# EAGLE design WoordklokCharles (EAGLE 7.2.0)
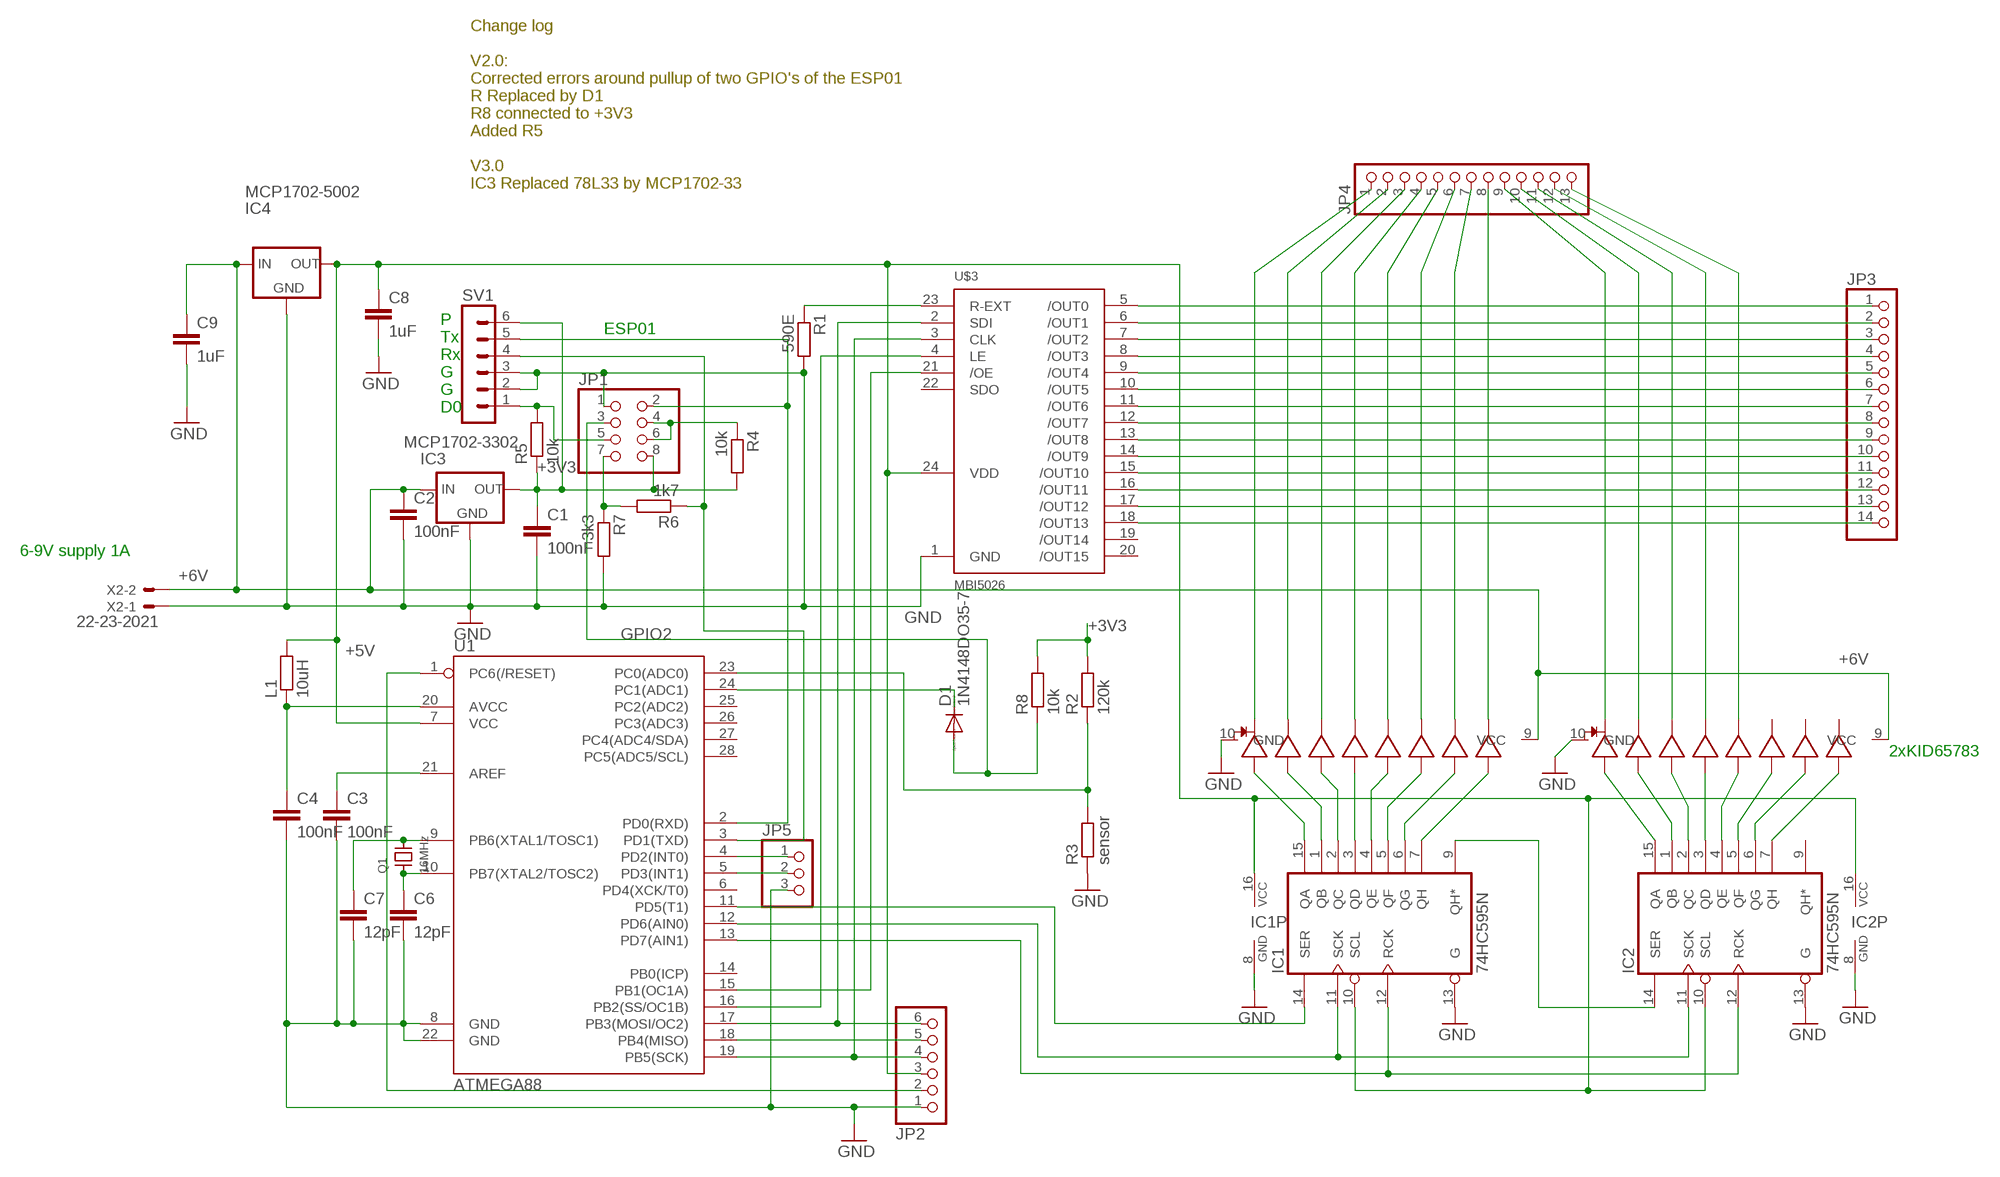
[diagram p0: schematic, sheet 1]

## Parts
C1  100nF  C-EU025-024X044  [C025-024X044]
C2  100nF  C-EU025-024X044  [C025-024X044]
C3  100nF  C-EU025-024X044  [C025-024X044]
C4  100nF  C-EU025-024X044  [C025-024X044]
C6  12pF  C-EU025-024X044  [C025-024X044]
C7  12pF  C-EU025-024X044  [C025-024X044]
C8  1uF  C-EU025-024X044  [C025-024X044]
C9  1uF  C-EU025-024X044  [C025-024X044]
D1  1N4148DO35-7  [DO35-7]
IC1  74HC595N  [DIL16]
IC2  74HC595N  [DIL16]
IC3  MCP1702-3302  MCP1700TRI  [TO92]
IC4  MCP1702-5002  MCP1700TRI  [TO92]
JP1  PINHD-2X4  [2X04]
JP2  PINHD-1X6  [1X06]
JP3  PINHD-1X14  [1X14]
JP4  PINHD-1X13  [1X13]
JP5  PINHD-1X3  [1X03]
L1  10uH  R-EU_0204/7  [0204/7]
Q1  16MHz  XTAL  [XTAL]
R1  590E  R-EU_0204/7  [0204/7]
R2  120k  R-EU_0204/7  [0204/7]
R3  sensor  R-EU_0204/7  [0204/7]
R4  10k  R-EU_0204/2V  [0204V]
R5  10k  R-EU_0204/2V  [0204V]
R6  1k7  R-EU_0204/7  [0204/7]
R7  3k3  R-EU_0204/7  [0204/7]
R8  10k  R-EU_0204/7  [0204/7]
SV1  MA06-1  [MA06-1]
U1  ATMEGA88  ATMEGA328P_PDIP  [DIL28-3]
U$1  KID65783  KID65783DIPDIP18  [DIP18]
U$2  KID65783  KID65783DIPDIP18  [DIP18]
U$3  MBI5026  MBI5026DIP  [DIP24]
X2  22-23-2021  [22-23-2021]

## Nets
+3V3: C1.1 IC3.3(OUT) JP1.8 R2.2 R4.2 R5.1 R8.2 SV1.6
+5V: C8.1 IC1.10(SCL) IC1.16(VCC) IC2.10(SCL) IC2.16(VCC) IC4.3(OUT) JP2.3 L1.2 U1.7(VCC) U$3.24(VDD)
+6V: C2.1 C9.1 IC3.2(IN) IC4.2(IN) U$1.9(VCC) U$2.9(VCC) X2.2
AVCC: C4.1 L1.1 U1.20(AVCC)
ESP2: JP1.2 SV1.5 U1.2(PD0(RXD))
ESP7: R6.1 SV1.4 U1.3(PD1(TXD))
GND: C1.2 C2.2 C3.2 C4.2 C6.2 C7.2 C8.2 C9.2 IC1.8(GND) IC1.13(G) IC2.8(GND) IC2.13(G) IC3.1(GND) IC4.1(GND) JP1.1 JP2.1 JP5.3 R1.2 R3.1 R7.2 SV1.2 SV1.3 U1.8(GND) U1.22(GND) U$1.10(GND) U$2.10(GND) U$3.1(GND) X2.1
GPIO2: D1.A JP1.3 R8.1
N$1: IC1.15(QA) U$1.8(IN7)
N$2: IC1.1(QB) U$1.7(IN6)
N$3: IC1.2(QC) U$1.6(IN5)
N$4: IC1.3(QD) U$1.5(IN4)
N$5: IC1.4(QE) U$1.4(IN3)
N$6: IC1.5(QF) U$1.3(IN2)
N$7: IC1.6(QG) U$1.2(IN1)
N$8: IC1.7(QH) U$1.1(IN0)
N$9: IC2.15(QA) U$2.8(IN7)
N$10: IC2.1(QB) U$2.7(IN6)
N$11: IC2.2(QC) U$2.6(IN5)
N$12: IC2.3(QD) U$2.5(IN4)
N$13: IC2.4(QE) U$2.4(IN3)
N$14: IC2.5(QF) U$2.3(IN2)
N$15: IC2.6(QG) U$2.2(IN1)
N$16: IC2.7(QH) U$2.1(IN0)
N$17: IC1.9(QH*) IC2.14(SER)
N$18: IC1.12(RCK) IC2.12(RCK) U1.13(PD7(AIN1))
N$19: IC1.11(SCK) IC2.11(SCK) U1.12(PD6(AIN0))
N$20: JP4.8 U$1.18(OUT0)
N$21: JP4.13 U$2.15(OUT3)
N$22: JP4.1 U$1.11(OUT7)
N$23: JP4.2 U$1.12(OUT6)
N$24: JP4.3 U$1.13(OUT5)
N$25: C3.1 U1.21(AREF)
N$26: JP3.2 U$3.6(/OUT1)
N$27: JP3.1 U$3.5(/OUT0)
N$28: R1.1 U$3.23(R-EXT)
N$29: JP1.5 R5.2 SV1.1
N$30: JP1.4 JP1.6 R4.1
N$31: JP2.4 U1.19(PB5(SCK)) U$3.3(CLK)
N$32: JP2.6 U1.17(PB3(MOSI/OC2)) U$3.2(SDI)
N$33: U1.16(PB2(SS/OC1B)) U$3.4(LE)
N$34: IC1.14(SER) U1.11(PD5(T1))
N$35: JP5.1 U1.4(PD2(INT0))
N$36: JP5.2 U1.5(PD3(INT1))
N$37: R2.1 R3.2 U1.23(PC0(ADC0))
N$38: JP2.5 U1.18(PB4(MISO))
N$39: JP2.2 U1.1(PC6(/RESET))
N$40: JP4.4 U$1.14(OUT4)
N$41: JP4.5 U$1.15(OUT3)
N$42: C7.1 Q1.P$2 U1.9(PB6(XTAL1/TOSC1))
N$43: C6.1 Q1.P$1 U1.10(PB7(XTAL2/TOSC2))
N$44: JP4.6 U$1.16(OUT2)
N$45: JP4.7 U$1.17(OUT1)
N$46: U1.15(PB1(OC1A)) U$3.21(/OE)
N$47: JP4.9 U$2.11(OUT7)
N$48: JP4.10 U$2.12(OUT6)
N$49: JP4.11 U$2.13(OUT5)
N$50: JP4.12 U$2.14(OUT4)
N$51: JP3.14 U$3.18(/OUT13)
N$52: JP3.3 U$3.7(/OUT2)
N$53: JP3.4 U$3.8(/OUT3)
N$54: JP3.5 U$3.9(/OUT4)
N$55: JP3.6 U$3.10(/OUT5)
N$56: JP3.7 U$3.11(/OUT6)
N$57: JP3.8 U$3.12(/OUT7)
N$58: JP3.9 U$3.13(/OUT8)
N$59: JP3.10 U$3.14(/OUT9)
N$60: JP3.11 U$3.15(/OUT10)
N$61: JP3.12 U$3.16(/OUT11)
N$62: JP3.13 U$3.17(/OUT12)
N$63: JP1.7 R6.2 R7.1
N$65: D1.C U1.24(PC1(ADC1))
Unconnected: IC2.9(QH*) U1.6(PD4(XCK/T0)) U1.14(PB0(ICP)) U1.25(PC2(ADC2)) U1.26(PC3(ADC3)) U1.27(PC4(ADC4/SDA)) U1.28(PC5(ADC5/SCL)) U$2.16(OUT2) U$2.17(OUT1) U$2.18(OUT0) U$3.19(/OUT14) U$3.20(/OUT15) U$3.22(SDO)

## Notes on the sheet
- Change log
  
  V2.0: 
  Corrected errors around pullup of two GPIO's of the ESP01
  R Replaced by D1
  R8 connected to +3V3
  Added R5
  
  V3.0 
  IC3 Replaced 78L33 by MCP1702-33
- ESP01
- P
  Tx
  Rx
  G
  G
  D0
- 6-9V supply 1A
- 2xKID65783

## Library data of the parts
C1-C4 C6-C9 = rcl:C-EU: CAPACITOR, European symbol
D1 = diode:1N4148: DIODE high speed (Philips)
IC1 IC2 = 74xx-eu:74*595: 8-bit SHIFT REGISTER, output latch
IC3 IC4 = adafruit:MCP1700: VOLTAGE REGULATOR
JP1 = adafruit:PINHD-2X4: PIN HEADER
JP2 = adafruit:PINHD-1X6: PIN HEADER
JP3 = adafruit:PINHD-1X14: PIN HEADER
JP4 = adafruit:PINHD-1X13: PIN HEADER
JP5 = adafruit:PINHD-1X3: PIN HEADER
L1 R1-R8 = rcl:R-EU_: RESISTOR, European symbol
Q1 = xtal-cvdo:XTAL
SV1 = con-lstb:MA06-1: PIN HEADER; OC_FARNELL: unknown; OC_NEWARK: unknown
U1 = SparkFun-DigitalIC:ATMEGA328P_PDIP: uC used in the Arduino 32kb flash, 1k EEPROM, 2k SRAM This is the through-hole version of this chip.
U$1 U$2 = KID65783:KID65783DIP
U$3 = LedDrivers:MBI5026DIP
X2 = con-molex:22-23-2021: .100" (2.54mm) Center Header - 2 Pin; MF: MOLEX; MPN: 22-23-2021; OC_FARNELL: 1462926; OC_NEWARK: 25C3832

## Board
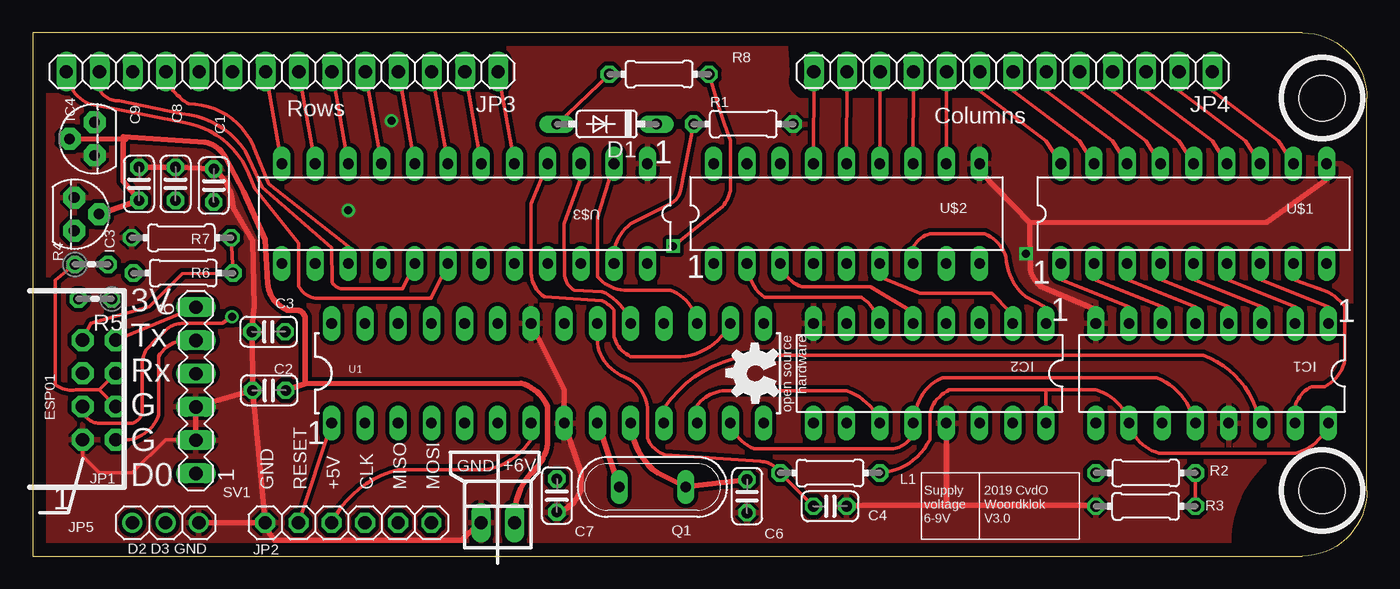
[diagram p1: board, top side]
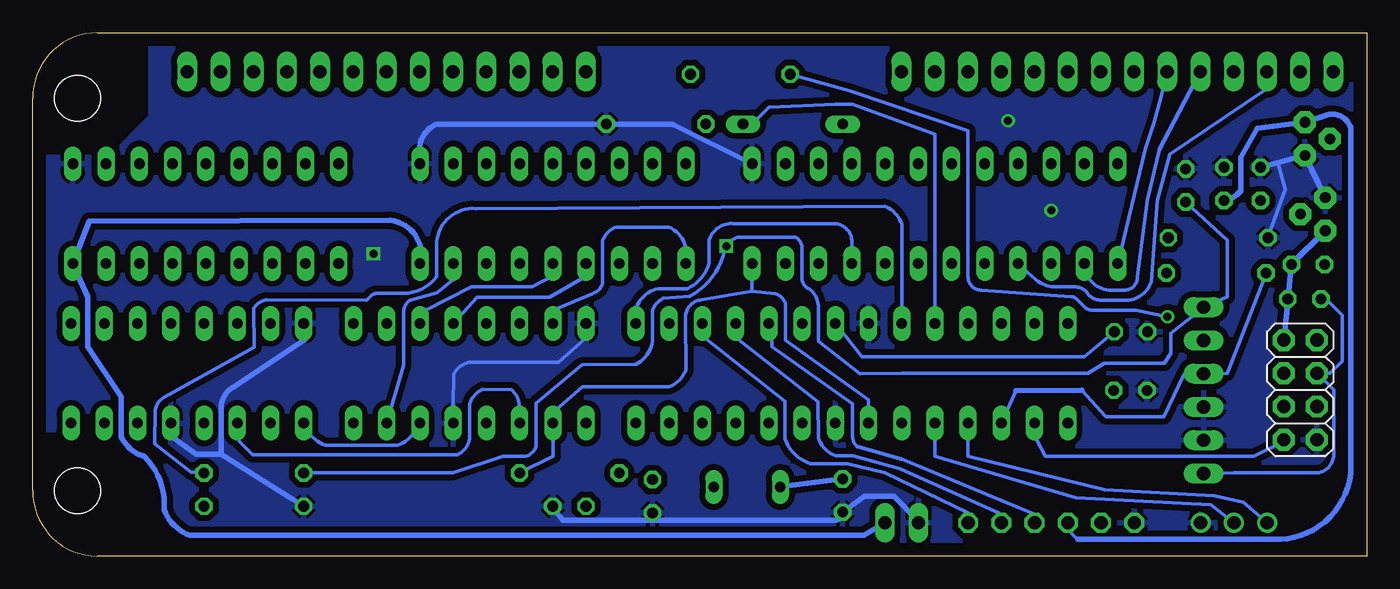
[diagram p2: board, bottom side, seen from below]

Size 102 x 40 mm. Coordinates in mm from the lower left corner, seen from the top.
Outline: 0,0 97.08,0 arc90 102,5 102,35 arc90 97.08,40 0,40 0,0
Copper layers (1*16): Top 0.035mm / dielectric 1.5mm / Bottom 0.035mm
Design rules "default *": minimum track width 10mil, minimum drill 24mil, track to track 0.203453125mm, track to pad 0.203453125mm, pad to pad 0.203453125mm, via to via 0.203453125mm, smd to smd 0.203453125mm, copper to edge 40mil, drill to drill 8mil, minimum pad ring 10mil, minimum via ring 8mil, stop-mask expansion 4mil, vias tented up to drill 0mil, thermal gap 10mil
Holes 3.5 mm at 98.58,5 98.58,35

### Footprints (pad centres in the part's own frame; a part is rotated, then mirrored left to right if it is on the bottom)
C025-024X044 = drill 0.813 octagon: 1 -1.27,0; 2 1.27,0
DO35-7 = drill 0.813 long: A 3.81,0; C -3.81,0
DIL16 = drill 0.813 long: 1 -8.89,-3.81; 2 -6.35,-3.81; 3 -3.81,-3.81; 4 -1.27,-3.81; 5 1.27,-3.81; 6 3.81,-3.81; 7 6.35,-3.81; 8 8.89,-3.81; 9 8.89,3.81; 10 6.35,3.81; 11 3.81,3.81; 12 1.27,3.81; 13 -1.27,3.81; 14 -3.81,3.81; 15 -6.35,3.81; 16 -8.89,3.81
TO92 = drill 0.813 pad 1.676 octagon: 1 -1.27,0; 2 0,1.905; 3 1.27,0
2X04 = drill 1.016 pad 1.676 octagon: 1 -3.81,-1.27; 2 -3.81,1.27; 3 -1.27,-1.27; 4 -1.27,1.27; 5 1.27,-1.27; 6 1.27,1.27; 7 3.81,-1.27; 8 3.81,1.27
1X06 = drill 1.016 octagon: 1 -6.35,0; 2 -3.81,0; 3 -1.27,0; 4 1.27,0; 5 3.81,0; 6 6.35,0
1X14 = drill 1.016 long: 1 -16.51,0; 2 -13.97,0; 3 -11.43,0; 4 -8.89,0; 5 -6.35,0; 6 -3.81,0; 7 -1.27,0; 8 1.27,0; 9 3.81,0; 10 6.35,0; 11 8.89,0; 12 11.43,0; 13 13.97,0; 14 16.51,0
1X13 = drill 1.016 long: 1 -15.24,0; 2 -12.7,0; 3 -10.16,0; 4 -7.62,0; 5 -5.08,0; 6 -2.54,0; 7 0,0; 8 2.54,0; 9 5.08,0; 10 7.62,0; 11 10.16,0; 12 12.7,0; 13 15.24,0
1X03 = drill 1.016: 1 -2.54,0; 2 0,0; 3 2.54,0
0204/7 = drill 0.813 octagon: 1 -3.81,0; 2 3.81,0
XTAL = drill 0.8 long: P$1 -2.54,0; P$2 2.54,0
0204V = drill 0.813 octagon: 1 -1.27,0; 2 1.27,0
MA06-1 = drill 1.016 long: 1 -6.35,0; 2 -3.81,0; 3 -1.27,0; 4 1.27,0; 5 3.81,0; 6 6.35,0
DIL28-3 = drill 0.813 long: 1 -16.51,-3.81; 2 -13.97,-3.81; 3 -11.43,-3.81; 4 -8.89,-3.81; 5 -6.35,-3.81; 6 -3.81,-3.81; 7 -1.27,-3.81; 8 1.27,-3.81; 9 3.81,-3.81; 10 6.35,-3.81; 11 8.89,-3.81; 12 11.43,-3.81; 13 13.97,-3.81; 14 16.51,-3.81; 15 16.51,3.81; 16 13.97,3.81; 17 11.43,3.81; 18 8.89,3.81; 19 6.35,3.81; 20 3.81,3.81; 21 1.27,3.81; 22 -1.27,3.81; 23 -3.81,3.81; 24 -6.35,3.81; 25 -8.89,3.81; 26 -11.43,3.81; 27 -13.97,3.81; 28 -16.51,3.81
DIP18 = drill 0.813 long: 1 -10.16,-3.81; 2 -7.62,-3.81; 3 -5.08,-3.81; 4 -2.54,-3.81; 5 0,-3.81; 6 2.54,-3.81; 7 5.08,-3.81; 8 7.62,-3.81; 9 10.16,-3.81; 10 10.16,3.81; 11 7.62,3.81; 12 5.08,3.81; 13 2.54,3.81; 14 0,3.81; 15 -2.54,3.81; 16 -5.08,3.81; 17 -7.62,3.81; 18 -10.16,3.81
DIP24 = drill 0.813 long: 1 -13.97,-3.81; 2 -11.43,-3.81; 3 -8.89,-3.81; 4 -6.35,-3.81; 5 -3.81,-3.81; 6 -1.27,-3.81; 7 1.27,-3.81; 8 3.81,-3.81; 9 6.35,-3.81; 10 8.89,-3.81; 11 11.43,-3.81; 12 13.97,-3.81; 13 13.97,3.81; 14 11.43,3.81; 15 8.89,3.81; 16 6.35,3.81; 17 3.81,3.81; 18 1.27,3.81; 19 -1.27,3.81; 20 -3.81,3.81; 21 -6.35,3.81; 22 -8.89,3.81; 23 -11.43,3.81; 24 -13.97,3.81
22-23-2021 = drill 1 long: 1 -1.27,0; 2 1.27,0

### Placement (x,y rotation side)
C1  13.84,28.32 90 top
C2  18.08,12.67 180 top
C3  18.03,17.14 180 top
C4  60.96,3.81 0 top
C6  54.61,4.57 270 top
C7  40.08,4.63 270 top
C8  10.92,28.45 90 top
C9  8.13,28.45 90 top
D1  43.88,33.01 180 top
IC1  90.17,13.97 180 top
IC2  68.58,13.97 180 top
IC3  3.17,26.13 270 top
IC4  4.73,31.89 90 top
JP1  5.08,12.7 90 bottom
JP2  24.13,2.54 0 top
JP3  19.07,37.02 180 top
JP4  74.95,37.02 180 top
JP5  10.16,2.54 0 top
L1  60.96,6.35 0 top
Q1  47.38,5.28 180 top
R1  54.34,33.02 0 top
R2  85.09,6.35 180 top
R3  85.09,3.81 0 top
R4  4.49,22.29 0 top
R5  4.77,19.65 180 top
R6  11.51,21.63 0 top
R7  11.37,24.33 180 top
R8  47.89,36.83 0 top
SV1  12.48,12.67 90 top
U1  39.37,13.97 0 top
U$1  88.77,26.17 0 top
U$2  62.23,26.17 0 top
U$3  33.02,26.17 180 top
U$4  [OSHW_5MM]  55.24,13.97 90 top
X2  35.56,2.54 0 top

### Tracks (layer width: path | path; a pad name or v marks a point on that pad's centre or on a via)
+3V3  (via drill 0.61)
  Top 0.254: JP1.8 SV1.6 | R8.2 52.07,35.56 arc5 53.34,31.75 53.34,27.94 arc-30 52.72,26.72 v48.97,23.69
  Bottom 0.254: R2.2 69.85,6.35 66.04,7.62 64.26,7.62 arc-50 63.5,8.38 63.5,11.68 59.99,14.63 55.87,14.65 arc-50 54.61,16.41 54.59,18.78 arc50 53.8,19.69 53.8,19.71 51.76,19.87 51.77,19.85 arc-50 49.1,23.36 48.97,23.49 v48.97,23.69 arc50 48.01,24.38 43.69,24.38 arc50 43.18,23.62 43.18,21.08 arc-50 42.58,20.38 arc50 41.92,18.99 41.92,16.43 38.74,13.95 35.56,13.97 21.34,13.97 20.07,14.73 15.49,14.73 14.99,15.49 14.99,17.02 SV1.6 10.67,19.81 10.67,24.13 C1.1 | R5.1 6.09,19.6 6.09,19.02
  Bottom 0.406: JP1.8 6.09,19.02 R4.2 IC3.3
+5V
  Top 0.254: 77.47,12.7 IC2.16 | 77.47,12.7 70.1,12.7 arc50 68.58,10.92 68.58,8.89 arc-60 L1.2 | 77.47,12.7 81.28,12.7 arc-60 IC1.10 arc60 86.11,7.87 96.52,7.87 arc60 IC1.16 | U1.7 38.1,8.89 arc-50 34.54,6.6 27.94,6.6 arc50 JP2.3
  Bottom 0.254: L1.2 62.23,7.62 IC2.10 61.98,11.18 59.94,12.95 53.34,12.95 arc-50 52.07,14.22 52.08,18.21 arc90 50.86,19.57 46.99,20.25 | U$3.24 46.99,20.41 | 46.99,20.41 46.99,20.32 46.99,20.25 | 46.99,20.25 45.21,20.07 arc50 44.45,19.3 44.45,16.51 38.1,11.94 U1.7 | 22.1,1.27 arc50 JP2.3 | 46.99,20.25 46.99,20.41
  Bottom 0.406: C8.1 arc-50 9.65,27.94 9.65,30.48 8.36,32.71 IC4.3 2.98,33.74 3.13,33.7 arc90 1.22,32.73 1.22,6.31 arc80 6.6,1.27 22.1,1.27
+6V
  Top 0.406: C2.1 20.83,13.18 | 20.83,13.18 37.34,13.21 arc-50 39.37,11.43 39.37,9.14 arc-50 38.35,6.6 arc50 X2.2 | 20.83,13.18 20.83,14.99 20.83,18.29 arc50 20.32,18.8 19.47,18.8 arc-60 17.95,20.83 17.78,24.17 16.13,27.83 14.76,30.44 arc50 13.19,31.62 6.92,32.04 | 6.92,32.04 7.11,31.86 IC4.2 | 6.92,32.04 6.92,28.66 C9.1 IC3.2
  Bottom 0.406: X2.2 38.44,1.57 89.97,1.57 arc50 91.95,3.56 arc-50 93.47,7.62 arc50 95.25,9.14 95.25,12.19 97.79,16 97.79,19.81 U$1.9 97.67,25.57 74.68,25.65 arc100 U$2.9
AVCC
  Top 0.254: 57.23,6.17 L1.1 | L1.1 arc60 55.63,7.23 48.31,7.75 arc-50 47.01,9 47.01,11.35 arc60 45.21,13.72 arc-60 43.18,16.26 U1.20 | C4.1 L1.1
ESP2
  Top 0.254: SV1.5 11.45,16.49 arc50 9.62,15.26 9.65,10.79 arc-60 7.37,8.89 JP1.2
  Bottom 0.254: U1.2 25.33,8.92 25.23,8.87 24.58,7.62 8.64,7.62 6.1,8.89 JP1.2
ESP7
  Bottom 0.254: R6.1 10.67,13.97 SV1.4 14,13.85 15.5,10.64 19.95,10.65 21.79,12.66 | U1.3 26.82,12.63
  Bottom 0.406: 26.82,12.63 21.79,12.66
GND  (via drill 0.61)
  Top 0.254: 81.2,18.87 IC1.8 | 76.25,25.49 76.22,25.46 | 98.81,28.68 U$1.10 | 16.76,17.17 C3.2 | 17.53,2.52 17.88,2.52 JP2.1 | 34.11,2.52 X2.1 | SV1.2 12.44,8.89 10.16,8.89 7.62,6.35 5.08,6.35 3.81,7.62 JP1.1
  Top 0.406: C4.2 63.52,3.89 66.98,3.89 69.85,3.88 | 81.2,18.87 77.29,20.5 arc-50 76.28,21.95 76.25,25.49 72.46,29.37 U$2.10 | 98.81,28.68 94.36,25.5 76.22,25.46 | 17.53,2.52 18.48,1.22 32.78,1.22 34.11,2.52 | C7.2 arc60 41.91,5.08 41.91,6.35 U1.8 40.64,12.7 U1.22 | JP5.3 JP2.1 C2.2 | C2.2 C3.2 arc-3 16.91,19.07 16.8,24.08 15.32,26.6 arc50 C1.2 C8.2 C9.2 | C2.2 SV1.3 SV1.2 | 69.85,3.88 80.48,3.88 R3.1 | IC2.13 69.85,3.88
  Bottom 0.254: 91.26,9.04 IC1.13 | IC2.8 59.73,16.63 61.78,14.8 68.68,14.79 arc-50 69.83,13.88 69.87,11.48 IC2.13 | 81.18,16.59 IC1.8 | 34.34,2.74 X2.1 | R7.2 6.22,28.02 6.79,30.07
  Bottom 0.406: 91.26,9.04 89.51,7.8 87.6,7.8 | 81.18,16.59 86.61,12.95 arc-50 87.6,11.51 87.6,7.8 | 34.34,2.74 36.17,4.57 38.4,4.57 C7.2 arc90 40.69,2.74 54.61,2.74 | 54.61,2.74 61.47,2.74 62.18,3.56 C4.2 | C6.2 54.61,2.74 | U$2.10 72.39,30.48 arc80 71.12,33.02 R1.2 53.09,33.02 53.01,32.98 U$3.1 | 87.6,7.8 R3.1 | C9.2 6.79,30.07 IC4.1 IC3.1
  other vias: 75.95,23.11 27.43,33.27 24.13,26.42
  pour Top (isolate 0.305): 91.44,0 0,0 0,27.43 -0.04,34.44 arc-90 -0.23,35.17 34.8,35.31 arc-90 35.05,35.05 35.05,38.61 arc-90 36.32,39.88 57.4,39.88 arc-10 57.66,36.83 arc90 58.67,34.8 92.96,34.8 arc90 99.06,30.48 arc-87 101.85,25.4 101.85,12.45 99.57,9.4 arc90 91.44,0.76
  pour Bottom (isolate 0.457): 0,0 91.44,0 91.44,5.07 arc-45 91.63,5.52 95.76,9.65 101.85,9.65 101.85,30.48 96.78,30.48 arc45 96.33,30.29 96.27,30.23 92.96,33.53 92.96,39.88 0.09,39.96 arc90 0,39.24
GPIO2  (via drill 0.61)
  Top 0.254: v15.24,18.29 14.48,17.78 11.43,17.78 arc44 10.16,17.27 arc3 8.89,16 arc44 8.38,14.73 8.38,11.18 arc-74 7.62,10.16 5.08,10.16 arc-90 JP1.3 | D1.A R8.1
  Top 0.406: D1.A 40.08,33.01
  Bottom 0.254: R8.1 39.56,35.56 30.48,32.51 30.48,21.34 arc-90 29.46,20.32 22.61,19.81 arc53 22.1,19.56 21.59,19.05 arc-53 20.83,18.8 17.65,18.8 v15.24,18.29
N$1
  Top 0.254: IC1.15 96.52,11.43 arc-50 97.79,12.95 98.81,12.95 arc50 100.33,14.99 100.33,19.05 arc30 98.81,20.29 96.52,21.08 U$1.8
N$2
  Top 0.254: IC1.1 99.06,19.05 93.98,21.08 U$1.7
N$3
  Top 0.254: IC1.2 96.52,19.05 91.44,21.08 U$1.6
N$4
  Top 0.254: IC1.3 93.98,19.05 88.9,21.08 U$1.5
N$5
  Top 0.254: IC1.4 91.44,19.05 86.36,21.08 U$1.4
N$6
  Top 0.254: IC1.5 88.9,19.05 83.82,21.08 U$1.3
N$7
  Top 0.254: IC1.6 86.36,19.05 81.28,21.08 U$1.2
N$8
  Top 0.254: IC1.7 83.82,19.05 78.74,21.08 U$1.1
N$9
  Bottom 0.254: IC2.15 73.65,14.6 73.63,18.76 arc50 73.15,19.56 71.09,20.11 69.85,21.13 70,22.17 U$2.8
N$10
  Top 0.254: IC2.1 77.32,19.1 75.95,19.81 arc-50 74.42,22.86 arc50 72.8,24.64 68.58,24.64 arc50 67.23,23.44 U$2.7
N$11
  Top 0.254: IC2.2 74.72,18.67 73.32,20.08 67.84,20.08 64.93,21.29 U$2.6
N$12
  Bottom 0.254: IC2.3 72.05,18.75 68.46,20.57 63.83,20.57 62.23,21.41 U$2.5
N$13
  Bottom 0.254: IC2.4 69.77,17.83 68.04,19.8 62.48,19.8 60.02,21.2 U$2.4
N$14
  Top 0.254: IC2.5 67.26,17.83 66.99,18.81 64.06,20.57 58.8,20.57 arc-50 57.2,22.17 U$2.3
N$15
  Top 0.254: U$2.2 arc50 55.94,19.76 63.36,19.79 arc-40 IC2.6
N$16
  Bottom 0.254: U$2.1 arc-80 53.34,25.15 57.4,25.15 arc-50 58.42,24.13 58.42,20.83 arc50 59.18,20.07 62.23,18.8 IC2.7
N$17
  Bottom 0.254: IC2.14 72.52,10.06 arc50 74.12,8.46 79.6,8.46 arc50 81.2,10.06 IC1.9
N$18
  Top 0.254: IC1.12 88.75,10.29 arc60 85.93,13.61 69.55,13.61 arc70 67.49,10.29 IC2.12 67.31,9.86 arc-90 65.66,8.2 55.14,8.2 arc-50 U1.13
N$19
  Top 0.254: U1.12 50.8,10.29 50.76,11.46 arc-50 52.73,12.62 62.25,12.62 arc-50 64.75,10.29 IC2.11
  Bottom 0.254: IC1.11 86.23,8.79 85.19,7.75 69.52,7.75 arc-50 68.58,8.95 68.58,11.64 arc50 67.59,12.75 65.4,12.71 arc50 64.79,11.37 IC2.11
N$20
  Top 0.254: U$1.18 77.47,31.75 72.39,35.56 JP4.8
N$21
  Top 0.254: U$2.15 JP4.13
N$22
  Top 0.254: U$1.11 95.25,31.75 90.17,35.56 JP4.1
N$23
  Top 0.254: U$1.12 92.71,31.75 87.63,35.56 JP4.2
N$24
  Top 0.254: U$1.13 90.17,31.75 85.09,35.56 JP4.3
N$25
  Bottom 0.254: U1.21 38.61,15.24 21.59,15.24 C3.1
N$26
  Top 0.254: U$3.6 JP3.2
N$27
  Top 0.254: U$3.5 JP3.1
N$28
  Top 0.254: R1.1 49.53,27.94 arc-50 48.77,26.92 45.72,25.4 arc60 U$3.23
N$29
  Bottom 0.254: SV1.1 10.16,6.35 3.81,6.35 arc-80 2.54,7.62 2.54,12.7 JP1.5 2.82,13.97 1.89,14.89 1.89,18.4 3.14,19.65 R5.2
N$30
  Top 0.254: R4.1 1.73,21.09 1.71,13.12 arc50 3.3,12.7 5.08,12.7 | 5.08,12.7 JP1.6 | JP1.4 5.08,12.7
N$31
  Top 0.254: U$3.3 42.05,29.24 40.62,25.41 40.66,21.42 arc50 41.4,20.32 43.51,20.22 arc-50 U1.19
  Bottom 0.254: 35.61,7.44 25.51,3.22 25.43,2.74 JP2.4 | 38.95,8.39 arc50 39.31,9.04 39.34,11.64 45.47,16 45.54,17.6 U1.19
  Bottom 0.305: 38.95,8.39 35.61,7.44
N$32
  Top 0.254: U$3.2 43.18,25.91 43.18,21.34 arc50 45.47,20.32 48.77,20.32 arc-60 U1.17
  Bottom 0.254: JP2.6 30.54,3.13 30.5,3.31 36.83,6.35 39.72,7.07 42.53,7.06 arc50 44.5,8.95 44.5,11.81 50.67,16.74 U1.17
N$33
  Top 0.254: U1.16 arc-60 49.53,15.24 45.72,15.24 arc-50 44.45,16.76 44.45,18.8 arc30 43.52,19.5 39.12,19.81 arc-50 38.1,21.59 38.1,26.92 U$3.4
N$34
  Top 0.254: U1.11 48.28,10.29 48.3,11.38 arc-50 55.18,15.36 89.48,15.34 arc-60 93.78,10.29 IC1.14
N$35
  Bottom 0.254: U1.4 30.48,7.62 20.02,5.08 11.68,4.63 9.46,4.1 JP5.1
N$36
  Bottom 0.254: JP5.2 11.94,3.94 22.23,4.45 33.02,7.62 U1.5
N$37
  Top 0.254: R3.2 R2.1
  Bottom 0.254: R2.1 88.98,6.4 89.89,6.4 92.66,8.58 92.63,11.2 arc50 91.95,12.13 85.07,15.97 85.09,18.92 arc50 84.15,19.57 76.45,19.56 76.12,19.89 arc45 75.67,20.08 73.53,20.08 arc-50 71.12,21.33 71.12,23.45 arc100 68.11,26.56 36.88,26.74 arc50 35.56,25.39 U1.23
N$38
  Bottom 0.254: U1.18 48.09,17.02 48.09,16.56 41.95,11.79 41.93,9.01 arc-50 40.6,7.66 39.3,7.67 35.71,6.67 28.09,3.29 JP2.5
N$39
  Top 0.254: U1.1 JP2.2
N$40
  Top 0.254: U$1.14 87.63,31.75 82.55,35.56 JP4.4
N$41
  Top 0.254: U$1.15 85.09,31.75 80.01,35.56 JP4.5
N$42
  Top 0.254: 43.26,10.06 U1.9
  Top 0.406: 43.26,10.06 Q1.P$2
  Bottom 0.406: C7.1 Q1.P$2
N$43
  Top 0.406: C6.1 Q1.P$1 47.75,6.35 arc-50 U1.10
N$44
  Top 0.254: U$1.16 82.55,31.75 77.47,35.56 JP4.6
N$45
  Top 0.254: U$1.17 80.01,31.75 74.93,35.56 JP4.7
N$46
  Bottom 0.254: U1.15 arc100 53.98,20.45 51.94,20.45 arc-50 50.29,22.38 50.29,24.16 arc80 48.26,25.4 40.64,25.4 arc80 39.37,24.13 U$3.21
N$47
  Top 0.254: U$2.11 JP4.9
N$48
  Top 0.254: U$2.12 JP4.10
N$49
  Top 0.254: U$2.13 JP4.11
N$50
  Top 0.254: U$2.14 JP4.12
N$51
  Top 0.254: JP3.14 2.54,36.99 arc60 4.28,34.57 11.46,33.14 arc-60 16.51,29.21 16.95,28.11 20.32,23.9 20.32,20.63 arc50 21.61,19.71 30.47,19.7 U$3.18
N$52
  Top 0.254: U$3.7 JP3.3
N$53
  Top 0.254: U$3.8 JP3.4
N$54
  Top 0.254: U$3.9 JP3.5
N$55
  Top 0.254: U$3.10 JP3.6
N$56
  Top 0.254: U$3.11 JP3.7
N$57
  Top 0.254: U$3.12 JP3.8
N$58
  Bottom 0.254: U$3.13 16.92,31.14 arc-8 JP3.9
N$59
  Bottom 0.254: 15.85,31.06 16.76,27.18 17.53,21.34 arc90 18.54,20.32 19.55,20.32 arc90 U$3.14
  Bottom 0.305: 15.85,31.06 JP3.10
N$60
  Top 0.254: JP3.11 arc50 11.23,35.1 arc20 11.92,34.56 arc-70 17.02,30.99 18.03,28.45 24.11,23.69 U$3.15
N$61
  Bottom 0.254: U$3.16 25.29,21.12 arc-41 23.88,20.57 arc-2 22.35,20.57 arc55 21.34,20.07 arc-55 20.32,19.56 18.54,19.56 arc-79 16.49,20.98 16,27.18 15.06,30.73 7.87,35.56 JP3.12
N$62
  Top 0.254: U$3.17 28.27,20.43 23.62,20.43 arc-50 22.88,20.94 22.85,23.55 17.53,28.19 16.26,30.99 arc50 11.4,33.8 6.6,34.8 arc-60 5.16,35.56 JP3.13
N$63
  Top 0.254: R7.1 R6.2 11.43,21.59 8.89,19.05 4.45,17.78 JP1.7
N$65
  Bottom 0.254: U1.24 33.02,32.26 39.32,34.54 40.64,34.54 45.72,34.29 47,33.01
  Bottom 0.406: 47.7,33.01 D1.C 47,33.01

### Text on the board
tPlace: Supply / voltage / 6-9V
tNames: Rows | Columns | 1 | 1 | 1 | 1 | 1 | ESP01 | 1 | GND | +6V | 3V / Tx / Rx / G / G / D0 | GND | RESET | +5V | CLK | MISO | MOSI | 1 | 2019 CvdO / Woordklok / V3.0 | D2 D3 GND